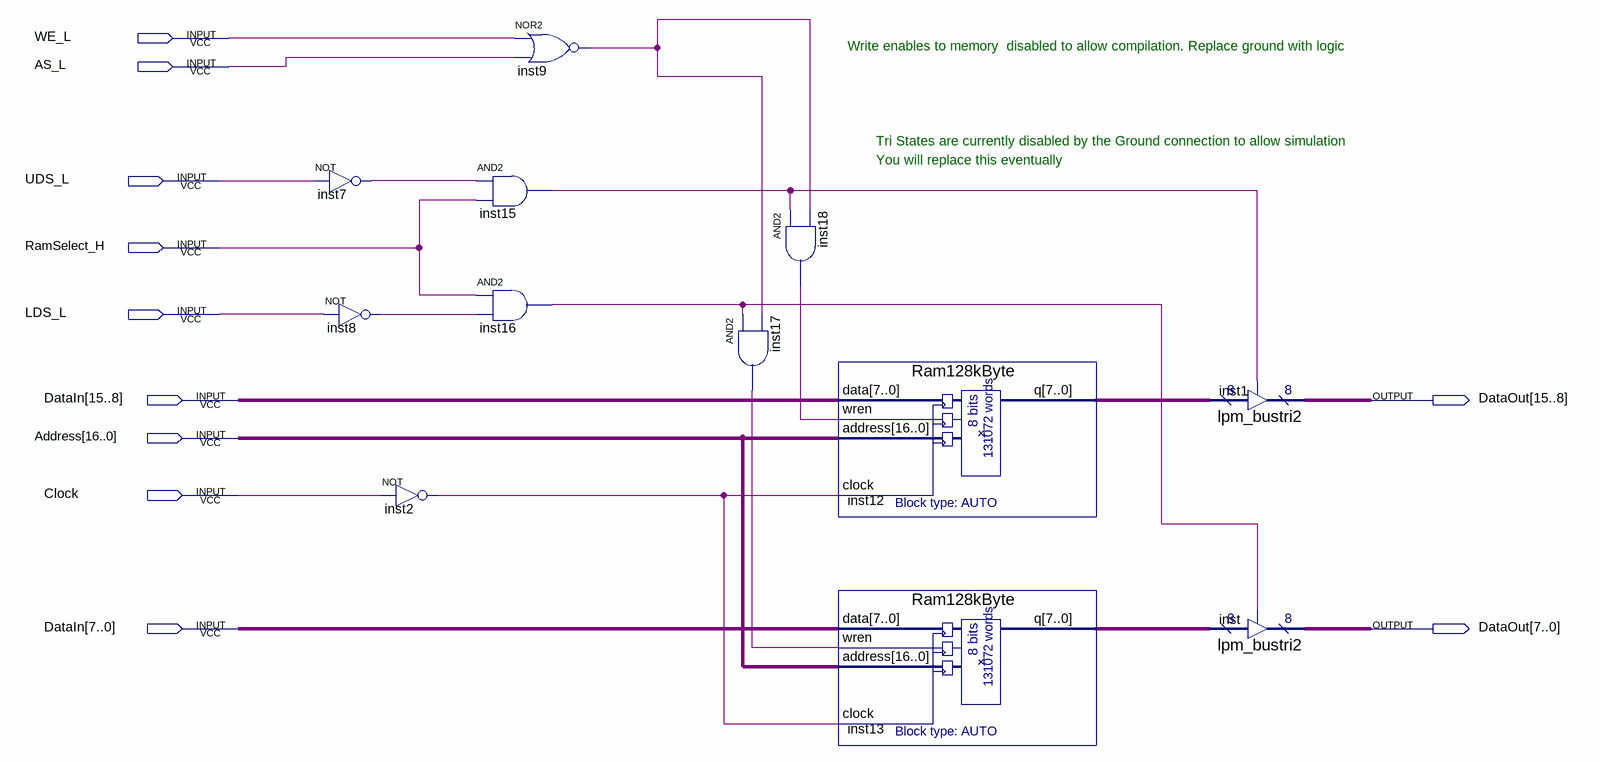
[diagram p0: schematic sheet]
// Quartus schematic OnChipRam256kbyte.bdf as structural Verilog: 12 symbols, 11 pins
module OnChipRam256kbyte (
  input  WE_L,
  input  AS_L,
  input  UDS_L,
  input  RamSelect_H,
  input  LDS_L,
  input  [15:0] DataIn,
  input  [16:0] Address,
  input  Clock,
  output [15:0] DataOut
);

  wire inst2_out, inst7_out, inst8_out, inst9_out, inst15_out, inst16_out, inst17_out, inst18_out;
  wire [7:0] inst12_q, inst13_q;

  not inst7 (inst7_out, UDS_L);
  not inst8 (inst8_out, LDS_L);
  not inst2 (inst2_out, Clock);
  nor inst9 (inst9_out, WE_L, AS_L);
  and inst15 (inst15_out, inst7_out, RamSelect_H);
  and inst16 (inst16_out, RamSelect_H, inst8_out);
  and inst17 (inst17_out, inst16_out, inst9_out);
  and inst18 (inst18_out, inst15_out, inst9_out);
  Ram128kByte inst12 (.data(DataIn[15:8]), .wren(inst18_out), .address(Address), .clock(inst2_out), .q(inst12_q));
  Ram128kByte inst13 (.data(DataIn[7:0]), .wren(inst17_out), .address(Address), .clock(inst2_out), .q(inst13_q));
  lpm_bustri2 inst1 (.enabledt(inst15_out), .data(inst12_q), .tridata(DataOut[15:8]));
  lpm_bustri2 inst (.enabledt(inst16_out), .data(inst13_q), .tridata(DataOut[7:0]));

  // Notes on the sheet:
  //   Write enables to memory  disabled to allow compilation. Replace ground with logic
  //   Tri States are currently disabled by the Ground connection to allow simulation
  //   You will replace this eventually
endmodule
